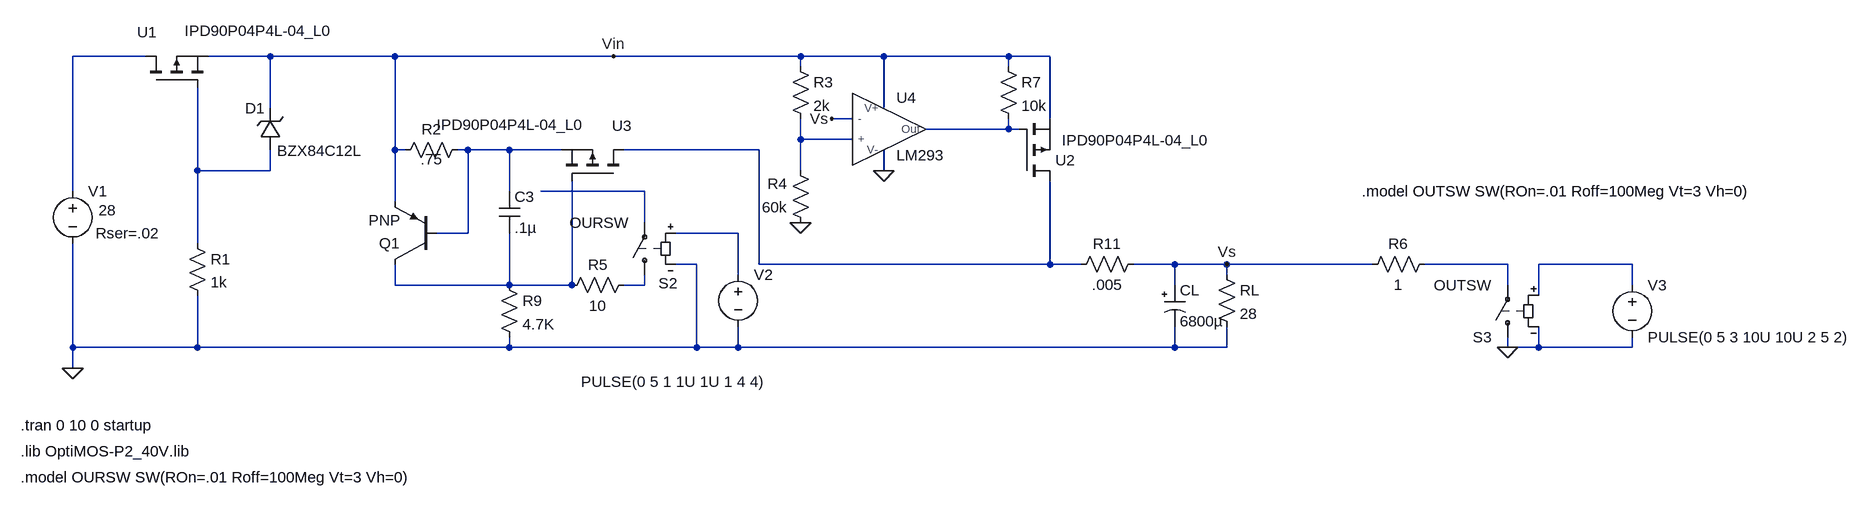
[diagram p0: schematic power_cond_7x.asc]
power_cond_7x.asc, the LTspice schematic file:
Version 4
SHEET 1 2268 1624
WIRE -1280 -176 -1392 -176
WIRE -1088 -176 -1184 -176
WIRE -896 -176 -1088 -176
WIRE -560 -176 -896 -176
WIRE -272 -176 -560 -176
WIRE -144 -176 -272 -176
WIRE 48 -176 -144 -176
WIRE 112 -176 48 -176
WIRE -272 -160 -272 -176
WIRE 48 -160 48 -176
WIRE -1088 -96 -1088 -176
WIRE -144 -96 -144 -176
WIRE -192 -80 -224 -80
WIRE 112 -80 112 -176
WIRE 48 -64 48 -80
WIRE 48 -64 -80 -64
WIRE 64 -64 48 -64
WIRE -272 -48 -272 -80
WIRE -192 -48 -272 -48
WIRE -896 -32 -896 -176
WIRE -880 -32 -896 -32
WIRE -784 -32 -800 -32
WIRE -720 -32 -784 -32
WIRE -640 -32 -720 -32
WIRE -336 -32 -544 -32
WIRE -1200 0 -1200 -128
WIRE -1088 0 -1088 -32
WIRE -1088 0 -1200 0
WIRE -272 0 -272 -48
WIRE -144 0 -144 -32
WIRE -1392 32 -1392 -176
WIRE -720 32 -720 -32
WIRE -512 32 -672 32
WIRE -896 48 -896 -32
WIRE -512 80 -512 32
WIRE -784 96 -784 -32
WIRE -784 96 -832 96
WIRE -368 96 -464 96
WIRE -1200 112 -1200 0
WIRE -432 144 -464 144
WIRE -336 144 -336 -32
WIRE 112 144 112 16
WIRE 112 144 -336 144
WIRE 160 144 112 144
WIRE 304 144 240 144
WIRE 384 144 304 144
WIRE 608 144 384 144
WIRE 816 144 688 144
WIRE 1008 144 864 144
WIRE -368 160 -368 96
WIRE 384 160 384 144
WIRE -896 176 -896 144
WIRE -720 176 -720 96
WIRE -720 176 -896 176
WIRE -624 176 -624 16
WIRE -624 176 -720 176
WIRE -512 176 -512 160
WIRE -512 176 -544 176
WIRE 304 176 304 144
WIRE 816 176 816 144
WIRE 1008 176 1008 144
WIRE 864 192 864 144
WIRE -1392 272 -1392 112
WIRE -1200 272 -1200 192
WIRE -1200 272 -1392 272
WIRE -720 272 -720 256
WIRE -720 272 -1200 272
WIRE -432 272 -432 144
WIRE -432 272 -720 272
WIRE -368 272 -368 240
WIRE -368 272 -432 272
WIRE 304 272 304 240
WIRE 304 272 -368 272
WIRE 384 272 384 240
WIRE 384 272 304 272
WIRE 816 272 816 256
WIRE 864 272 864 240
WIRE 864 272 816 272
WIRE 1008 272 1008 256
WIRE 1008 272 864 272
WIRE -1392 304 -1392 272
FLAG -1392 304 0
FLAG 384 144 Vs
FLAG -144 0 0
FLAG -272 80 0
FLAG -224 -80 Vs
FLAG -560 -176 Vin
FLAG 816 272 0
SYMBOL voltage -1392 16 R0
WINDOW 3 40 45 Left 2
WINDOW 123 0 0 Left 2
WINDOW 39 35 80 Left 2
SYMATTR Value 28
SYMATTR SpiceLine Rser=.02
SYMATTR InstName V1
SYMBOL res -1216 96 R0
SYMATTR InstName R1
SYMATTR Value 1k
SYMATTR SpiceLine tol=1 pwr=.125
SYMBOL polcap 288 176 R0
WINDOW 3 24 56 Left 2
SYMATTR Value 6800µ
SYMATTR InstName CL
SYMATTR SpiceLine V=35 Irms=3.67 Rser=0.03 Lser=0
SYMATTR Description Capacitor
SYMATTR Type cap
SYMBOL res 368 144 R0
SYMATTR InstName RL
SYMATTR Value 28
SYMBOL zener -1072 -32 R180
WINDOW 0 24 64 Left 2
WINDOW 3 -126 -1 Left 2
SYMATTR InstName D1
SYMATTR Value BZX84C12L
SYMBOL pmos -1280 -128 R270
WINDOW 0 85 -13 VRight 2
WINDOW 3 87 60 VRight 2
SYMATTR InstName U1
SYMATTR Value IPD90P04P4L-04_L0
SYMATTR Prefix X
SYMBOL pmos 64 16 M180
WINDOW 3 66 63 Left 2
SYMATTR Value IPD90P04P4L-04_L0
SYMATTR InstName U2
SYMATTR Prefix X
SYMBOL res -784 -48 R90
WINDOW 0 0 56 VBottom 2
WINDOW 3 15 56 VTop 2
SYMATTR InstName R2
SYMATTR Value .75
SYMBOL pnp -832 144 R180
SYMATTR InstName Q1
SYMBOL cap -736 32 R0
SYMATTR InstName C3
SYMATTR Value .1µ
SYMBOL res -736 160 R0
SYMATTR InstName R9
SYMATTR Value 4.7K
SYMBOL pmos -544 16 M270
WINDOW 0 85 -13 VRight 2
WINDOW 3 87 60 VRight 2
SYMATTR InstName U3
SYMATTR Value IPD90P04P4L-04_L0
SYMATTR Prefix X
SYMBOL voltage -368 144 R0
WINDOW 3 -242 181 Left 2
WINDOW 123 0 0 Left 2
WINDOW 39 0 0 Left 2
SYMATTR Value PULSE(0 5 1 1U 1U 1 4 4)
SYMATTR InstName V2
SYMBOL sw -512 176 R180
WINDOW 0 -51 3 Left 2
SYMATTR InstName S2
SYMATTR Value OURSW
SYMBOL res -528 160 R90
WINDOW 0 0 56 VBottom 2
WINDOW 3 32 56 VTop 2
SYMATTR InstName R5
SYMATTR Value 10
SYMBOL voltage 1008 160 R0
WINDOW 123 0 0 Left 2
WINDOW 39 0 0 Left 2
SYMATTR InstName V3
SYMATTR Value PULSE(0 5 3 10U 10U 2 5 2)
SYMBOL sw 816 272 R180
SYMATTR InstName S3
SYMATTR Value OUTSW
SYMBOL res 704 128 R90
WINDOW 0 0 56 VBottom 2
WINDOW 3 32 56 VTop 2
SYMATTR InstName R6
SYMATTR Value 1
SYMBOL LM293 -144 -48 R0
WINDOW 0 35 -49 Bottom 2
WINDOW 3 57 9 Top 2
SYMATTR InstName U4
SYMBOL res -288 -176 R0
SYMATTR InstName R3
SYMATTR Value 2k
SYMBOL res -256 96 R180
WINDOW 0 36 76 Left 2
WINDOW 3 36 40 Left 2
SYMATTR InstName R4
SYMATTR Value 60k
SYMBOL res 32 -176 R0
SYMATTR InstName R7
SYMATTR Value 10k
SYMBOL res 256 128 R90
WINDOW 0 0 56 VBottom 2
WINDOW 3 32 56 VTop 2
SYMATTR InstName R11
SYMATTR Value .005
TEXT -1472 392 Left 2 !.tran 0 10 0 startup
TEXT -1472 432 Left 2 !.lib OptiMOS-P2_40V.lib
TEXT -1472 472 Left 2 !.model OURSW SW(ROn=.01 Roff=100Meg Vt=3 Vh=0)
TEXT 592 32 Left 2 !.model OUTSW SW(ROn=.01 Roff=100Meg Vt=3 Vh=0)

The netlist it stands for:
* power_cond_7x.asc
V1 N001 0 28 Rser=.02
R1 N006 0 1k tol=1 pwr=.125
CL Vs 0 6800µ V=35 Irms=3.67 Rser=0.03 Lser=0
RL Vs 0 28
D1 N006 Vin BZX84C12L
XU1 N001 N006 Vin IPD90P04P4L-04_L0  ; pins D G S
XU2 N005 N002 Vin IPD90P04P4L-04_L0  ; pins D G S
R2 N004 Vin .75
Q1 N011 N004 Vin 0 PNP
C3 N004 N011 .1µ
R9 N011 0 4.7K
XU3 N005 N011 N004 IPD90P04P4L-04_L0  ; pins D G S
V2 N008 0 PULSE(0 5 1 1U 1U 1 4 4)
S2 N012 N007 N008 0 OURSW
R5 N012 N011 10
V3 N010 0 PULSE(0 5 3 10U 10U 2 5 2)
S3 0 N009 N010 0 OUTSW
R6 N009 Vs 1
XU4 N003 Vs Vin 0 N002 LM293  ; pins + - V+ V- Out
R3 Vin N003 2k
R4 0 N003 60k
R7 Vin N002 10k
R11 Vs N005 .005
.model D D
.lib standard.dio
.model NPN NPN
.model PNP PNP
.lib standard.bjt
.tran 0 10 0 startup
.lib OptiMOS-P2_40V.lib
.model OURSW SW(ROn=.01 Roff=100Meg Vt=3 Vh=0)
.model OUTSW SW(ROn=.01 Roff=100Meg Vt=3 Vh=0)
.lib LM293.5_1
.backanno
.end